# EAGLE design AY Card V2 (EAGLE 6.6.0)
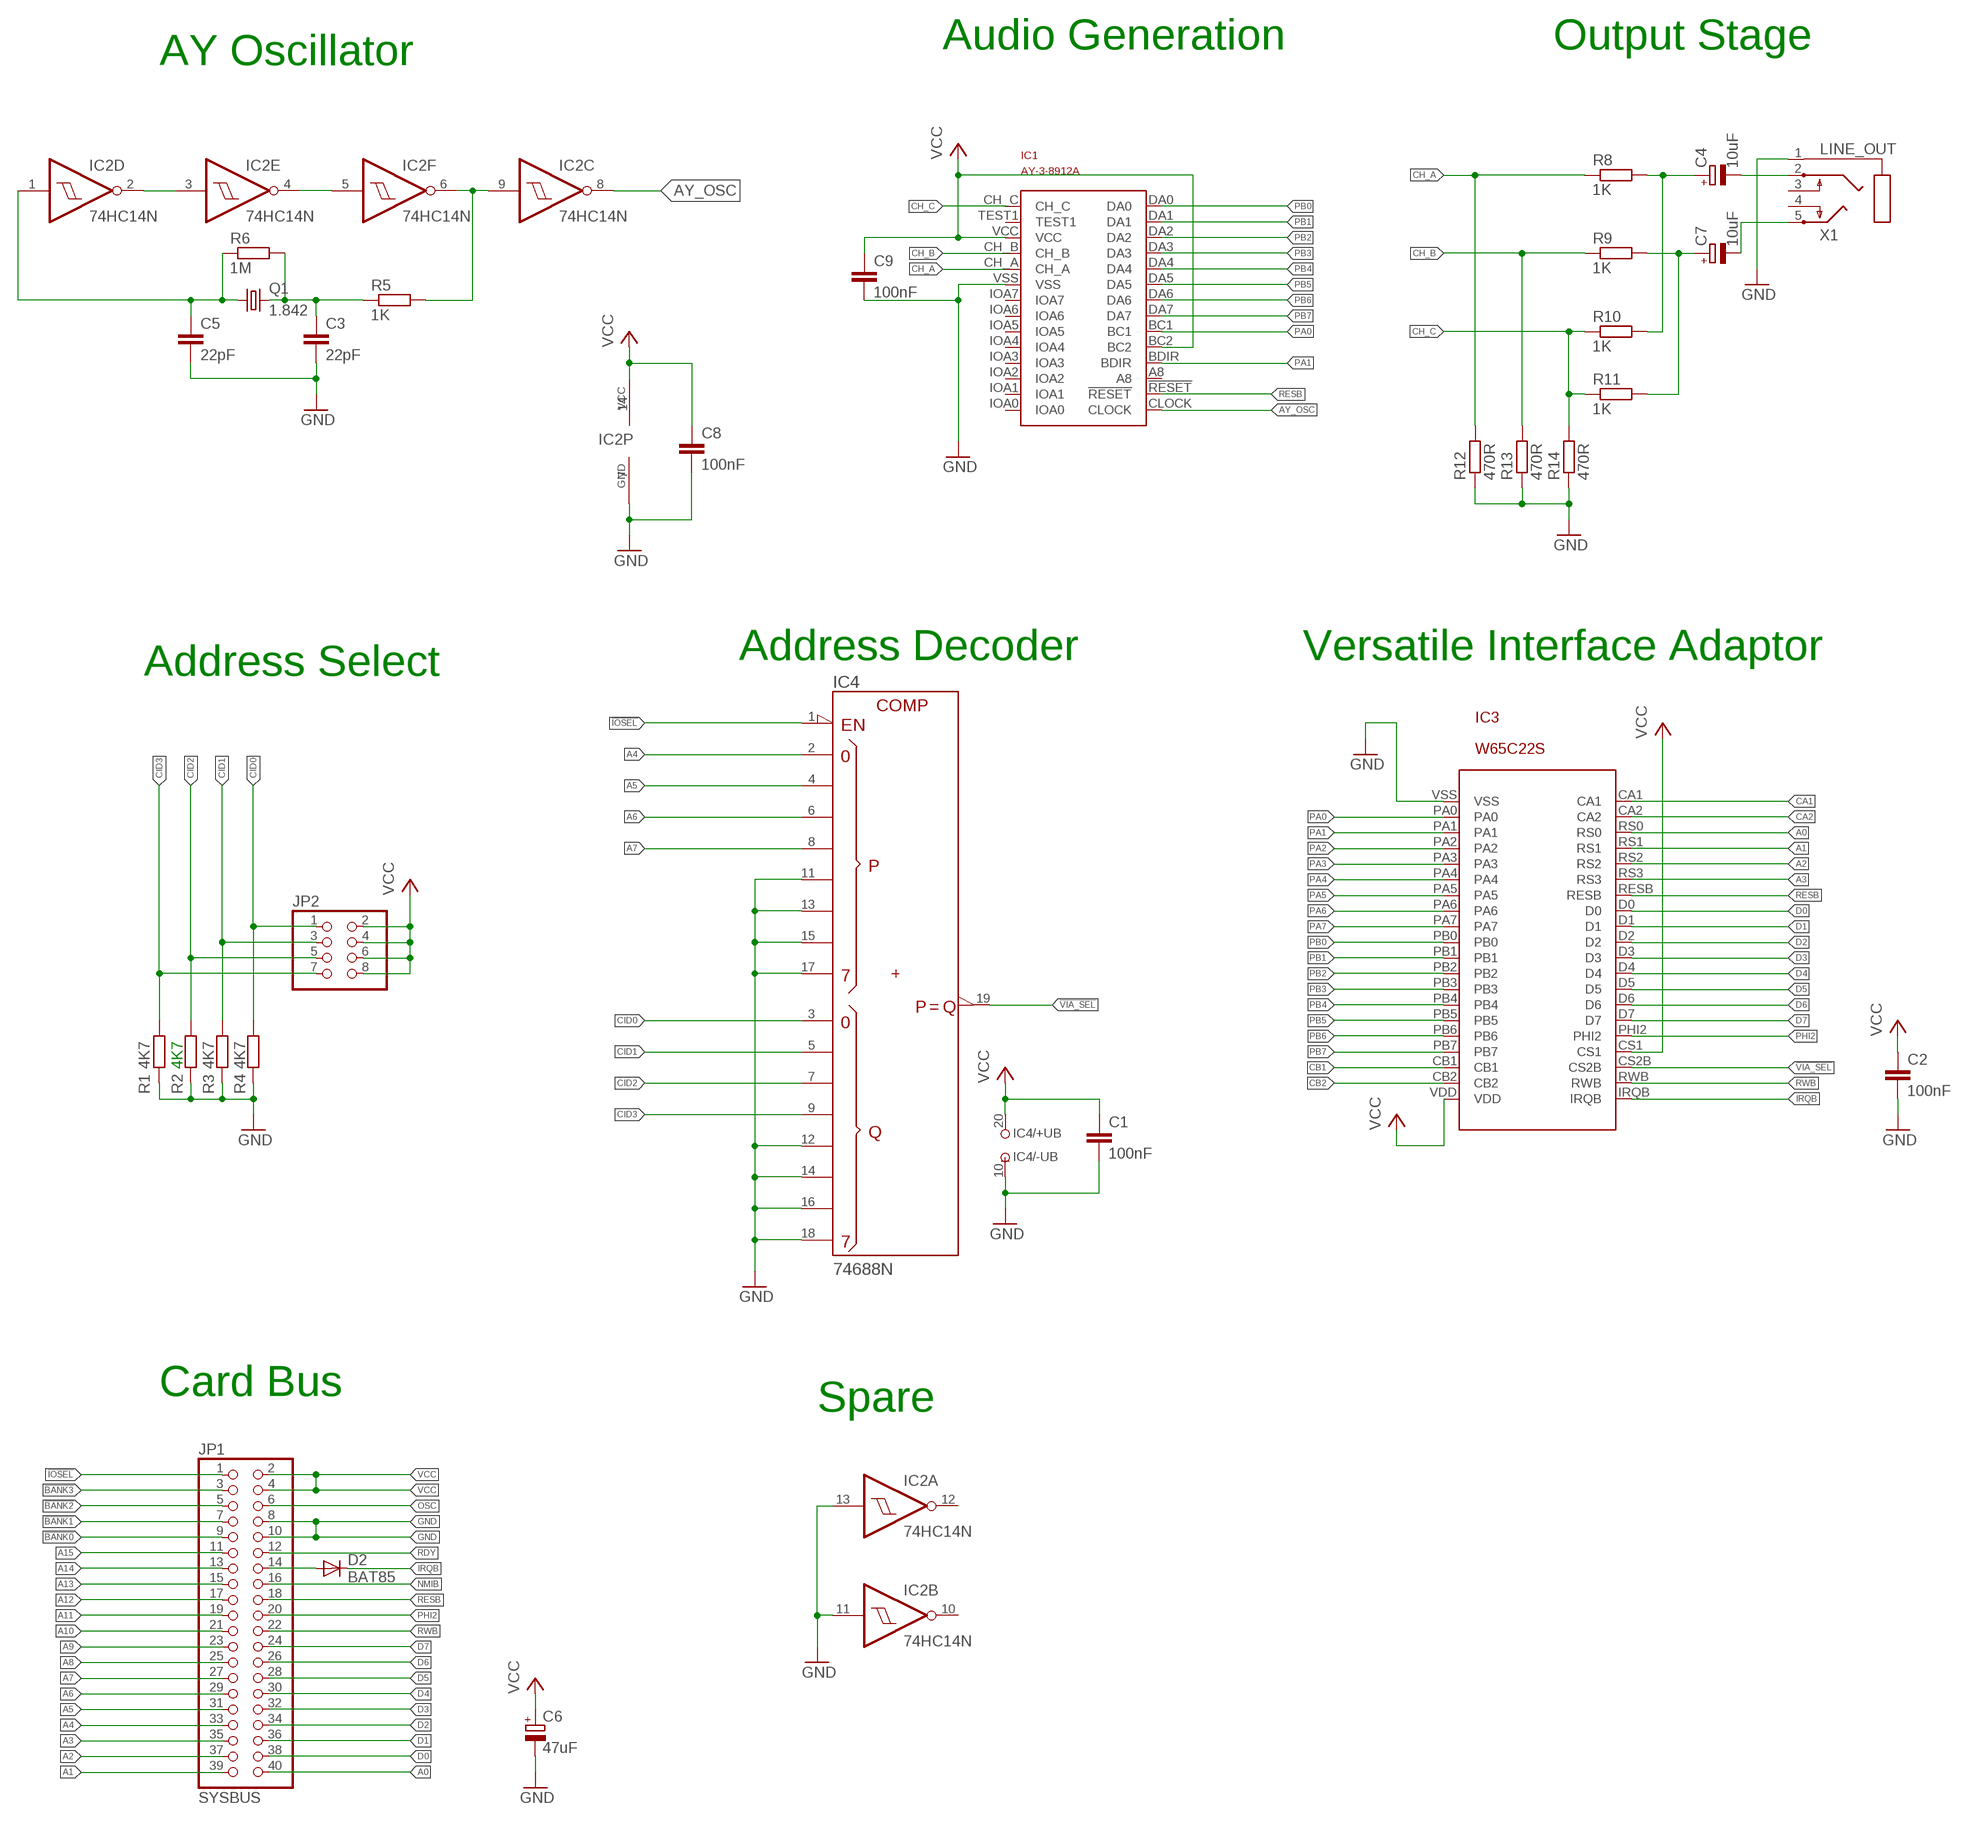
[diagram p0: schematic, sheet 1]

## Parts
C1  100nF  C-EU050-025X075  [C050-025X075]
C2  100nF  C-EU050-025X075  [C050-025X075]
C3  22pF  C-EU050-025X075  [C050-025X075]
C4  10uF  CPOL-EUE2-5  [E2-5]
C5  22pF  C-EU050-025X075  [C050-025X075]
C6  47uF  CPOL-EUE2.5-7  [E2,5-7]
C7  10uF  CPOL-EUE2-5  [E2-5]
C8  100nF  C-EU050-025X075  [C050-025X075]
C9  100nF  C-EU050-025X075  [C050-025X075]
D2  BAT85  BAT81  [DO34-7]
IC1  AY-3-8912A  AY-3-8912-DIP  [DIP]
IC2  74HC14N  7414N  [DIL14]
IC3  W65C22S  W65C22  [W65C22-DIP]
IC4  74688N  [DIL20]
JP1  SYSBUS  PINHD-2X20/90  [2X20/90]
JP2  PINHD-2X4  [2X04]
Q1  1.842  CRYSTALHC49S  [HC49/S]
R1  4K7  R-EU_0207/10  [0207/10]
R2  4K7  R-EU_0207/10  [0207/10]
R3  4K7  R-EU_0207/10  [0207/10]
R4  4K7  R-EU_0207/10  [0207/10]
R5  1K  R-EU_0207/2V  [0207/2V]
R6  1M  R-EU_0207/2V  [0207/2V]
R8  1K  R-EU_0207/2V  [0207/2V]
R9  1K  R-EU_0207/2V  [0207/2V]
R10  1K  R-EU_0207/2V  [0207/2V]
R11  1K  R-EU_0207/2V  [0207/2V]
R12  470R  R-EU_0207/2V  [0207/2V]
R13  470R  R-EU_0207/10  [0207/10]
R14  470R  R-EU_0207/10  [0207/10]
X1  LINE_OUT  STEREOJACK  [STX3100]

## Nets
!BANK0: JP1.9
!BANK1: JP1.7
!BANK2: JP1.5
!BANK3: JP1.3
!IOSEL: IC4.1(!G) JP1.1
!VIA_SEL: IC3.CS2B IC4.19(!P=Q)
A0: IC3.RS0 JP1.40
A1: IC3.RS1 JP1.39
A2: IC3.RS2 JP1.37
A3: IC3.RS3 JP1.35
A4: IC4.2(P0) JP1.33
A5: IC4.4(P1) JP1.31
A6: IC4.6(P2) JP1.29
A7: IC4.8(P3) JP1.27
A8: JP1.25
A9: JP1.23
A10: JP1.21
A11: JP1.19
A12: JP1.17
A13: JP1.15
A14: JP1.13
A15: JP1.11
AY_OSC: IC1.CLOCK IC2.8(C:O)
CA1: IC3.CA1
CA2: IC3.CA2
CB1: IC3.CB1
CB2: IC3.CB2
CH_A: IC1.CH_A R8.1 R12.2
CH_B: IC1.CH_B R9.1 R13.2
CH_C: IC1.CH_C R10.1 R11.1 R14.2
CID0: IC4.3(Q0) JP2.1 R4.2
CID1: IC4.5(Q1) JP2.3 R3.2
CID2: IC4.7(Q2) JP2.5 R2.2
CID3: IC4.9(Q3) JP2.7 R1.2
D0: IC3.D0 JP1.38
D1: IC3.D1 JP1.36
D2: IC3.D2 JP1.34
D3: IC3.D3 JP1.32
D4: IC3.D4 JP1.30
D5: IC3.D5 JP1.28
D6: IC3.D6 JP1.26
D7: IC3.D7 JP1.24
GND: C1.2 C2.2 C3.2 C5.2 C6.- C8.2 C9.2 IC1.VSS IC2.7(P:GND) IC2.11(B:I) IC2.13(A:I) IC3.VSS IC4.10(-UB) IC4.11(P4) IC4.12(Q4) IC4.13(P5) IC4.14(Q5) IC4.15(P6) IC4.16(Q6) IC4.17(P7) IC4.18(Q7) JP1.8 JP1.10 R1.1 R2.1 R3.1 R4.1 R12.1 R13.1 R14.1 X1.1
IRQB: D2.C IC3.IRQB
N$1: D2.A JP1.14
N$2: C4.+ R8.2 R10.2
N$3: C7.+ R9.2 R11.2
N$4: C7.- X1.5
N$5: C4.- X1.2
N$6: IC2.4(E:O) IC2.5(F:I)
N$7: IC2.6(F:O) IC2.9(C:I) R5.2
N$8: C3.1 Q1.2 R5.1 R6.2
N$9: C5.1 IC2.1(D:I) Q1.1 R6.1
N$10: IC2.2(D:O) IC2.3(E:I)
NMIB: JP1.16
OSC: JP1.6
PA0: IC1.BC1 IC3.PA0
PA1: IC1.BDIR IC3.PA1
PA2: IC3.PA2
PA3: IC3.PA3
PA4: IC3.PA4
PA5: IC3.PA5
PA6: IC3.PA6
PA7: IC3.PA7
PB0: IC1.DA0 IC3.PB0
PB1: IC1.DA1 IC3.PB1
PB2: IC1.DA2 IC3.PB2
PB3: IC1.DA3 IC3.PB3
PB4: IC1.DA4 IC3.PB4
PB5: IC1.DA5 IC3.PB5
PB6: IC1.DA6 IC3.PB6
PB7: IC1.DA7 IC3.PB7
PHI2: IC3.PHI2 JP1.20
RDY: JP1.12
RESB: IC1.!RESET IC3.RESB JP1.18
RWB: IC3.RWB JP1.22
VCC: C1.1 C2.1 C6.+ C8.1 C9.1 IC1.BC2 IC1.VCC IC2.14(P:VCC) IC3.CS1 IC3.VDD IC4.20(+UB) JP1.2 JP1.4 JP2.2 JP2.4 JP2.6 JP2.8
Unconnected: IC1.A8 IC1.IOA0 IC1.IOA1 IC1.IOA2 IC1.IOA3 IC1.IOA4 IC1.IOA5 IC1.IOA6 IC1.IOA7 IC1.TEST1 IC2.10(B:O) IC2.12(A:O) X1.3 X1.4

## Notes on the sheet
- Audio Generation | Output Stage
- AY Oscillator
- Address Decoder | Versatile Interface Adaptor
- Address Select
- Card Bus
- Spare

## Library data of the parts
C1-C3 C5 C8 C9 = rcl:C-EU: CAPACITOR, European symbol
C4 C6 C7 = rcl:CPOL-EU: POLARIZED CAPACITOR, European symbol
D2 = diode:BAT81: DIODE barrier diode
IC1 = ay-3-8912:AY-3-8912-DIP: Classic sound chip from the 80's Used in the Oric-1, Oric Atmos, Amstrad CPC's, some MSX's, Spectrum 128k machines etc.
IC2 = 74xx-us:74*14: Hex schmitt trigger INVERTER
IC3 = W65XX Support:W65C22
IC4 = 74ttl-din:74*688: 8-bit MAGNITUDE/IDENTITY COMPARATOR, totem pole
JP1 = pinhead:PINHD-2X20: PIN HEADER
JP2 = pinhead:PINHD-2X4: PIN HEADER
Q1 = crystal:CRYSTAL: CRYSTAL; OC_FARNELL: 1667008; OC_NEWARK: unknown
R1-R6 R8-R14 = rcl:R-EU_: RESISTOR, European symbol
X1 = adafruit:STEREOJACK: MIC/HEADPHONE JACK Stereo jack with two switches. Kycon STX3100, CUI SJ1-3555NG and/or 4UCon 05544

## Board
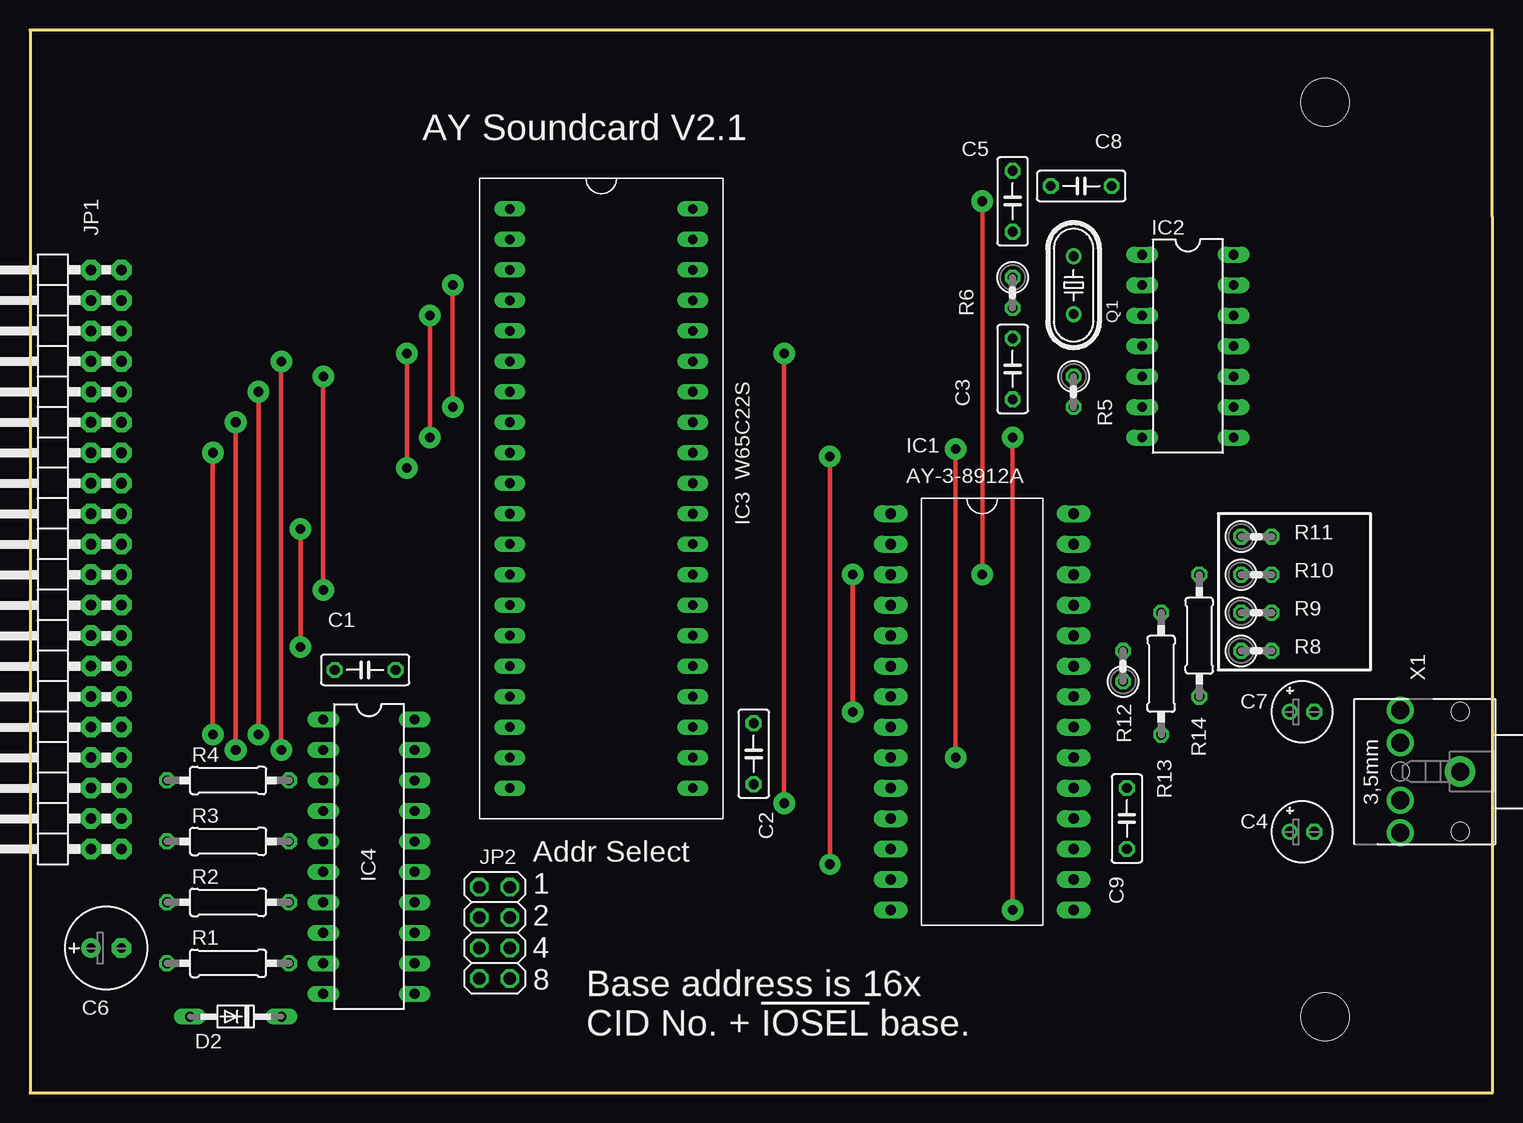
[diagram p1: board, top side]
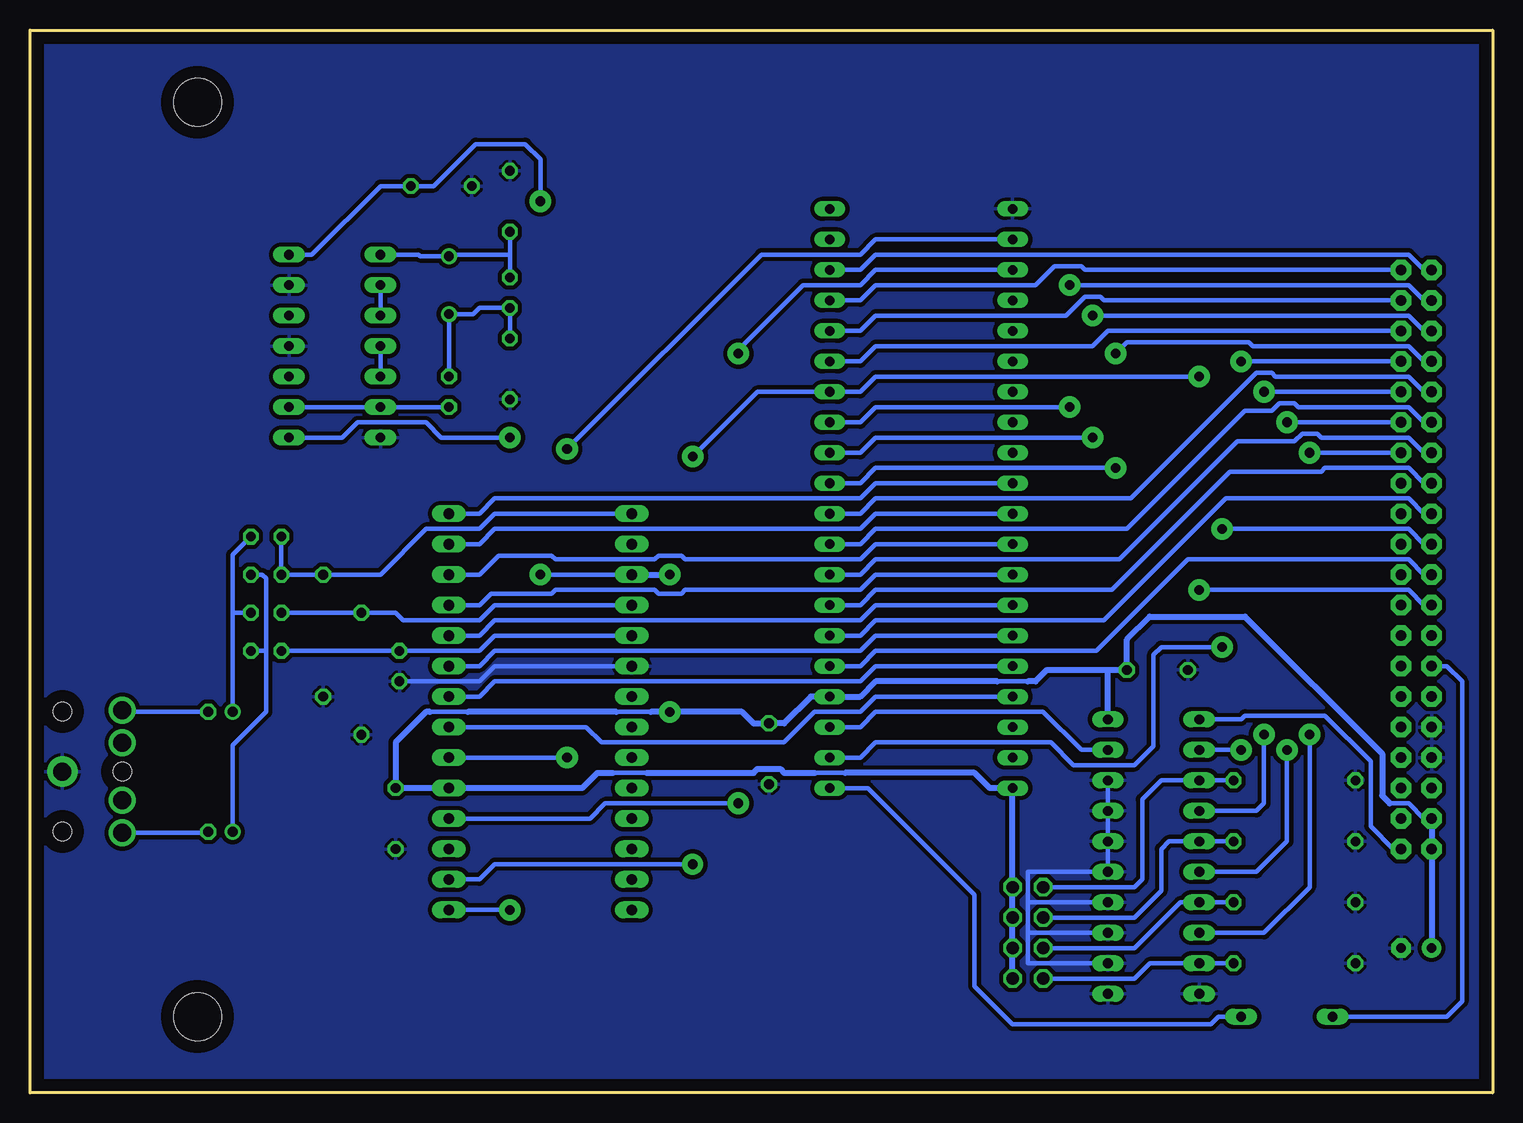
[diagram p2: board, bottom side, seen from below]

Size 121.92 x 88.57 mm. Coordinates in mm from the lower left corner, seen from the top.
Outline: 121.9,0 0,0 0,88.57 121.9,88.57 121.9,73.03 121.92,73.03 121.92,0
Copper layers (1*16): Top 0.035mm / dielectric 1.5mm / Bottom 0.035mm
Design rules "default *": minimum track width 10mil, minimum drill 24mil, track to track 6mil, track to pad 6mil, pad to pad 6mil, via to via 6mil, smd to smd 6mil, copper to edge 40mil, drill to drill 8mil, minimum pad ring 10mil, minimum via ring 8mil, stop-mask expansion 6mil, vias tented up to drill 0mil, thermal gap 10mil
Holes 4 mm at 107.95,82.55 107.95,6.35

### Footprints (pad centres in the part's own frame; a part is rotated, then mirrored left to right if it is on the bottom)
C050-025X075 = drill 0.813 octagon: 1 -2.54,0; 2 2.54,0
E2-5 = drill 0.813 pad 1.27: + -1.016,0 | drill 0.813 pad 1.27 octagon: - 1.016,0
E2,5-7 = drill 0.813 pad 1.6: + -1.27,0 | drill 0.813 pad 1.6 octagon: - 1.27,0
DO34-7 = drill 0.813 long: A 3.81,0; C -3.81,0
DIP = drill 0.9 long: !RESET 7.62,-15.24; A8 7.62,-12.7; BC1 7.62,-5.08; BC2 7.62,-7.62; BDIR 7.62,-10.16; CH_A -7.62,5.08; CH_B -7.62,7.62; CH_C -7.62,15.24; CLOCK 7.62,-17.78; DA0 7.62,15.24; DA1 7.62,12.7; DA2 7.62,10.16; DA3 7.62,7.62; DA4 7.62,5.08; DA5 7.62,2.54; DA6 7.62,0; DA7 7.62,-2.54; IOA0 -7.62,-17.78; IOA1 -7.62,-15.24; IOA2 -7.62,-12.7; IOA3 -7.62,-10.16; IOA4 -7.62,-7.62; IOA5 -7.62,-5.08; IOA6 -7.62,-2.54; IOA7 -7.62,0; TEST1 -7.62,12.7; VCC -7.62,10.16; VSS -7.62,2.54
DIL14 = drill 0.813 long: 1 -7.62,-3.81; 2 -5.08,-3.81; 3 -2.54,-3.81; 4 0,-3.81; 5 2.54,-3.81; 6 5.08,-3.81; 7 7.62,-3.81; 8 7.62,3.81; 9 5.08,3.81; 10 2.54,3.81; 11 0,3.81; 12 -2.54,3.81; 13 -5.08,3.81; 14 -7.62,3.81
W65C22-DIP = drill 0.8 long: CA1 7.62,24.13; CA2 7.62,21.59; CB1 -7.62,-19.05; CB2 -7.62,-21.59; CS1 7.62,-16.51; CS2B 7.62,-19.05; D0 7.62,6.35; D1 7.62,3.81; D2 7.62,1.27; D3 7.62,-1.27; D4 7.62,-3.81; D5 7.62,-6.35; D6 7.62,-8.89; D7 7.62,-11.43; IRQB 7.62,-24.13; PA0 -7.62,21.59; PA1 -7.62,19.05; PA2 -7.62,16.51; PA3 -7.62,13.97; PA4 -7.62,11.43; PA5 -7.62,8.89; PA6 -7.62,6.35; PA7 -7.62,3.81; PB0 -7.62,1.27; PB1 -7.62,-1.27; PB2 -7.62,-3.81; PB3 -7.62,-6.35; PB4 -7.62,-8.89; PB5 -7.62,-11.43; PB6 -7.62,-13.97; PB7 -7.62,-16.51; PHI2 7.62,-13.97; RESB 7.62,8.89; RS0 7.62,19.05; RS1 7.62,16.51; RS2 7.62,13.97; RS3 7.62,11.43; RWB 7.62,-21.59; VDD -7.62,-24.13; VSS -7.62,24.13
DIL20 = drill 0.813 long: 1 -11.43,-3.81; 2 -8.89,-3.81; 3 -6.35,-3.81; 4 -3.81,-3.81; 5 -1.27,-3.81; 6 1.27,-3.81; 7 3.81,-3.81; 8 6.35,-3.81; 9 8.89,-3.81; 10 11.43,-3.81; 11 11.43,3.81; 12 8.89,3.81; 13 6.35,3.81; 14 3.81,3.81; 15 1.27,3.81; 16 -1.27,3.81; 17 -3.81,3.81; 18 -6.35,3.81; 19 -8.89,3.81; 20 -11.43,3.81
2X20/90 = drill 0.889 pad 1.702 octagon: 1 -24.13,-6.35; 2 -24.13,-3.81; 3 -21.59,-6.35; 4 -21.59,-3.81; 5 -19.05,-6.35; 6 -19.05,-3.81; 7 -16.51,-6.35; 8 -16.51,-3.81; 9 -13.97,-6.35; 10 -13.97,-3.81; 11 -11.43,-6.35; 12 -11.43,-3.81; 13 -8.89,-6.35; 14 -8.89,-3.81; 15 -6.35,-6.35; 16 -6.35,-3.81; 17 -3.81,-6.35; 18 -3.81,-3.81; 19 -1.27,-6.35; 20 -1.27,-3.81; 21 1.27,-6.35; 22 1.27,-3.81; 23 3.81,-6.35; 24 3.81,-3.81; 25 6.35,-6.35; 26 6.35,-3.81; 27 8.89,-6.35; 28 8.89,-3.81; 29 11.43,-6.35; 30 11.43,-3.81; 31 13.97,-6.35; 32 13.97,-3.81; 33 16.51,-6.35; 34 16.51,-3.81; 35 19.05,-6.35; 36 19.05,-3.81; 37 21.59,-6.35; 38 21.59,-3.81; 39 24.13,-6.35; 40 24.13,-3.81
2X04 = drill 1.016 octagon: 1 -3.81,-1.27; 2 -3.81,1.27; 3 -1.27,-1.27; 4 -1.27,1.27; 5 1.27,-1.27; 6 1.27,1.27; 7 3.81,-1.27; 8 3.81,1.27
HC49/S = drill 0.813: 1 -2.413,0; 2 2.413,0
0207/10 = drill 0.813 octagon: 1 -5.08,0; 2 5.08,0
0207/2V = drill 0.813 octagon: 1 -1.27,0; 2 1.27,0
STX3100 = drill 1.5 pad 2.54: 1 2.7,-0.1 | drill 1.5: 2 7.7,5; 3 7.7,2.3; 4 7.7,-2.5; 5 7.7,-5.2 | hole 1.5: 2.7,4.9; 2.7,-5.1; 7.7,-0.1

### Placement (x,y rotation side)
C1  27.94,35.24 180 top
C2  60.33,28.26 270 top
C3  81.92,60.33 270 top
C4  106.05,21.75 0 top
C5  81.92,74.3 90 top
C6  6.35,12.06 0 top
C7  106.05,31.75 0 top
C8  87.63,75.56 180 top
C9  91.44,22.86 270 top
D2  17.14,6.35 180 top
IC1  79.38,33.02 0 top
IC2  96.52,62.23 270 top
IC3  47.62,49.53 0 top
IC4  28.26,19.68 270 top
JP1  1.27,44.45 90 top
JP2  38.73,13.34 270 top
Q1  87,67.31 270 top
R1  16.51,10.79 0 top
R2  16.51,15.88 0 top
R3  16.51,20.95 0 top
R4  16.51,26.04 0 top
R5  87,58.42 270 top
R6  81.92,66.67 270 top
R8  102.23,36.83 0 top
R9  102.23,40.01 0 top
R10  102.23,43.18 0 top
R11  102.23,46.35 0 top
R12  91.12,35.56 90 top
R13  94.3,34.92 90 top
R14  97.47,38.1 90 top
X1  121.92,26.67 180 top

### Tracks (layer width: path | path; a pad name or v marks a point on that pad's centre or on a via)
!IOSEL
  Bottom 0.356: IC4.1 20.95,31.11 20.64,31.43 13.97,31.43 10.16,27.62 10.16,22.23 8.26,20.32 JP1.1
!VIA_SEL
  Bottom 0.356: IC4.19 34.29,28.57 37.47,31.75 51.44,31.75 52.7,30.48 IC3.CS2B
A0
  Bottom 0.356: JP1.40 5.71,68.58 6.99,69.85 51.44,69.85 52.7,68.58 IC3.RS0
A1
  Bottom 0.356: JP1.39 33.97,68.58 34.29,68.9 36.51,68.9 38.1,67.31 51.44,67.31 52.7,66.04 IC3.RS1
A2
  Bottom 0.356: JP1.37 32.38,66.04 32.7,66.36 33.97,66.36 35.56,64.77 51.44,64.77 52.7,63.5 IC3.RS2
A3
  Bottom 0.356: JP1.35 32.07,63.5 33.34,62.23 51.44,62.23 52.7,60.96 IC3.RS3
A4  (via drill 0.8 pad 1.8)
  Top 0.356: v20.95,60.96 v20.95,28.57
  Bottom 0.356: JP1.33 v20.95,60.96 | IC4.2 v20.95,28.57
A5  (via drill 0.8 pad 1.8)
  Top 0.356: v19.05,58.42 v19.05,29.84
  Bottom 0.356: JP1.31 v19.05,58.42 | v19.05,29.84 19.05,24.13 19.68,23.5 IC4.4
A6  (via drill 0.8 pad 1.8)
  Top 0.356: v17.14,55.88 v17.14,28.57
  Bottom 0.356: JP1.29 v17.14,55.88 | v17.14,28.57 17.14,20.95 19.68,18.41 IC4.6
A7  (via drill 0.8 pad 1.8)
  Top 0.356: v15.24,53.34 v15.24,29.84
  Bottom 0.356: JP1.27 v15.24,53.34 | v15.24,29.84 15.24,17.14 19.05,13.34 IC4.8
AY_OSC  (via drill 0.8 pad 1.8)
  Top 0.356: v81.92,54.61 v81.92,15.24
  Bottom 0.356: IC2.8 95.89,54.61 94.61,55.88 88.9,55.88 87.63,54.61 v81.92,54.61 | v81.92,15.24 IC1.CLOCK
CH_A
  Bottom 0.356: IC1.CH_A 83.19,38.1 84.45,36.83 R12.2 R8.1
CH_B
  Bottom 0.356: IC1.CH_B 83.19,40.64 84.45,39.37 90.81,39.37 91.44,40.01 R13.2 R9.1
CH_C
  Bottom 0.356: IC1.CH_C 83.19,48.26 84.45,46.99 88.9,46.99 92.71,43.18 R14.2 R10.1 R11.1
CID0
  Bottom 0.356: JP2.1 29.84,17.14 29.21,17.78 29.21,24.45 27.62,26.04 IC4.3 R4.2
CID1
  Bottom 0.356: JP2.3 29.84,14.61 27.62,16.83 27.62,20.32 26.99,20.95 IC4.5 R3.2
CID2
  Bottom 0.356: JP2.5 29.84,12.06 26.04,15.88 IC4.7 R2.2
CID3
  Bottom 0.356: JP2.7 29.84,9.53 28.57,10.79 IC4.9 R1.2
D0  (via drill 0.8 pad 1.8)
  Top 0.356: v35.24,67.31 v35.24,57.15
  Bottom 0.356: JP1.38 5.71,66.04 6.99,67.31 v35.24,67.31 | v35.24,57.15 51.44,57.15 52.7,55.88 IC3.D0
D1  (via drill 0.8 pad 1.8)
  Top 0.356: v33.34,64.77 v33.34,54.61
  Bottom 0.356: JP1.36 5.71,63.5 6.99,64.77 v33.34,64.77 | v33.34,54.61 51.44,54.61 52.7,53.34 IC3.D1
D2  (via drill 0.8 pad 1.8)
  Top 0.356: v31.43,61.59 v31.43,52.07
  Bottom 0.356: JP1.34 5.71,60.96 6.99,62.23 20,62.23 20.32,62.55 30.48,62.55 v31.43,61.59 | v31.43,52.07 51.44,52.07 52.7,50.8 IC3.D2
D3
  Bottom 0.356: JP1.32 5.71,58.42 6.99,59.69 18.1,59.69 18.41,60.01 19.68,60.01 30.16,49.53 51.44,49.53 52.7,48.26 IC3.D3
D4
  Bottom 0.356: JP1.30 5.71,55.88 6.99,57.15 16.19,57.15 16.51,57.47 17.78,57.47 18.41,56.83 20.64,56.83 30.48,46.99 51.44,46.99 52.7,45.72 IC3.D4
D5
  Bottom 0.356: JP1.28 5.71,53.34 6.99,54.61 14.29,54.61 14.61,54.93 15.88,54.93 16.51,54.29 21.27,54.29 31.11,44.45 51.44,44.45 52.7,43.18 IC3.D5
D6
  Bottom 0.356: JP1.26 5.71,50.8 6.99,52.07 13.97,52.07 14.29,51.75 21.91,51.75 31.75,41.91 51.44,41.91 52.7,40.64 IC3.D6
D7
  Bottom 0.356: JP1.24 5.71,48.26 6.99,49.53 22.23,49.53 32.38,39.37 51.44,39.37 52.7,38.1 IC3.D7
GND
  Bottom 0.356: IC1.VSS 83.19,35.56 84.45,34.29 R12.1 | IC4.13 38.73,13.34 | 38.73,13.34 38.73,10.79 IC4.12 | IC4.18 IC4.17 IC4.16 IC4.15 38.73,18.41 38.73,15.88 | 38.73,15.88 38.73,13.34 | IC4.14 38.73,15.88
  pour Bottom (isolate 0.356): 0,88.9 0,0 122.24,0 122.24,88.9
IRQB
  Bottom 0.356: D2.C 22.86,6.35 23.5,5.71 40.01,5.71 43.18,8.89 43.18,16.51 52.07,25.4 IC3.IRQB
N$1
  Bottom 0.356: JP1.14 3.81,35.56 2.54,34.29 2.54,7.62 3.81,6.35 D2.A
N$2
  Bottom 0.356: R8.2 102.23,36.83 | 102.23,36.83 102.23,42.86 102.55,43.18 R10.2 | 102.23,36.83 102.23,31.75 105.03,28.96 C4.+
N$3
  Bottom 0.356: C7.+ 105.03,40.01 | 105.03,40.01 105.03,44.83 R11.2 | R9.2 105.03,40.01
N$4
  Bottom 0.356: X1.5 114.17,31.87 113.98,31.75 C7.-
N$5
  Bottom 0.356: X1.2 107.78,21.67 C4.-
N$6
  Bottom 0.356: IC2.4 IC2.5
N$7
  Bottom 0.356: R5.2 IC2.6 IC2.9
N$8
  Bottom 0.356: R5.1 Q1.2 84.96,64.9 84.45,65.41 R6.2 C3.1
N$9
  Bottom 0.356: IC2.1 89.53,69.85 89.41,69.72 Q1.1 86.87,69.85 81.92,69.85 | C5.1 81.92,69.85 | 81.92,69.85 R6.1
N$10
  Bottom 0.356: IC2.2 IC2.3
PA0  (via drill 0.8 pad 1.8)
  Top 0.356: v77.15,53.66 v77.15,27.94
  Bottom 0.356: IC3.PA0 51.44,71.12 52.7,69.85 60.96,69.85 v77.15,53.66 | v77.15,27.94 IC1.BC1
PA1  (via drill 0.8 pad 1.8)
  Top 0.356: v62.87,61.59 v62.87,24.13
  Bottom 0.356: IC3.PA1 51.44,68.58 52.7,67.31 57.47,67.31 62.87,61.91 v62.87,61.59 | v62.87,24.13 73.98,24.13 75.25,22.86 IC1.BDIR
PB0
  Bottom 0.356: IC3.PB0 51.44,50.8 52.7,49.53 83.19,49.53 84.45,48.26 IC1.DA0
PB1
  Bottom 0.356: IC1.DA1 84.45,45.72 83.19,46.99 52.7,46.99 51.44,48.26 IC3.PB1
PB2
  Bottom 0.356: IC1.DA2 84.45,43.18 82.87,44.77 78.42,44.77 78.11,44.45 69.85,44.45 69.53,44.77 67.63,44.77 67.31,44.45 52.7,44.45 51.44,45.72 IC3.PB2
PB3
  Bottom 0.356: IC1.DA3 84.45,40.64 83.5,41.59 78.42,41.59 78.11,41.91 69.85,41.91 69.53,41.59 67.63,41.59 67.31,41.91 52.7,41.91 51.44,43.18 IC3.PB3
PB4
  Bottom 0.356: IC1.DA4 84.45,38.1 83.19,39.37 52.7,39.37 51.44,40.64 IC3.PB4
PB5
  Bottom 0.356: IC1.DA5 84.45,35.56 83.19,36.83 52.7,36.83 51.44,38.1 IC3.PB5
PB6
  Bottom 0.356: IC1.DA6 84.45,33.02 83.19,34.29 52.7,34.29 51.44,35.56 IC3.PB6
PB7
  Bottom 0.356: IC1.DA7 75.56,30.48 74.3,29.21 59.05,29.21 56.52,31.75 52.7,31.75 51.44,33.02 IC3.PB7
PHI2
  Bottom 0.356: JP1.20 5.71,43.18 6.99,44.45 25.4,44.45 33.02,36.83 51.44,36.83 52.7,35.56 IC3.PHI2
RESB  (via drill 0.8 pad 1.75, 0.8 pad 1.8)
  Top 0.356: v24.45,41.91 v24.45,59.69 | v66.67,53.02 v66.67,19.05
  Bottom 0.356: JP1.18 5.71,40.64 6.99,41.91 v24.45,41.91 | v24.45,59.69 51.44,59.69 52.7,58.42 IC3.RESB 61.28,58.42 v66.67,53.02 | v66.67,19.05 83.19,19.05 84.45,17.78 IC1.!RESET
RWB  (via drill 0.8 pad 1.8)
  Top 0.356: v22.54,46.99 v22.54,37.15
  Bottom 0.356: JP1.22 5.71,45.72 6.99,46.99 v22.54,46.99 | IC3.RWB 52.7,27.94 51.44,29.21 36.83,29.21 34.92,27.3 29.84,27.3 28.26,28.89 28.26,36.51 27.62,37.15 v22.54,37.15
VCC  (via drill 0.8 pad 1.8)
  Top 0.356: v79.38,74.3 v79.38,43.18
  Top 0.406: v68.58,43.18 v68.58,31.75
  Bottom 0.356: 8.57,24.13 6.99,24.13 5.71,22.86 | 38.73,34.29 41.27,34.29 | 70.17,31.75 73.03,31.75 | 85.41,31.75 88.58,31.75 | 73.34,26.67 70.48,26.67 | 56.52,26.67 53.98,26.67 | v79.38,43.18 IC1.VCC | v79.38,74.3 79.38,77.79 80.64,79.06 84.77,79.06 88.27,75.56 C8.1 92.71,75.56 98.42,69.85 IC2.14
  Bottom 0.508: IC4.20 32.07,35.24 | 32.07,35.24 C1.1 30.48,37.78 28.57,39.69 20.64,39.69 9.21,28.26 9.21,24.77 8.57,24.13 | JP2.8 JP2.6 JP2.4 JP2.2 IC3.VDD 41.91,25.4 43.18,26.67 53.98,26.67 | C6.+ JP1.2 JP1.4 5.71,22.86 | IC1.VCC v68.58,43.18 | 32.07,35.24 37.15,35.24 38.1,34.29 38.73,34.29 | 41.27,34.29 51.44,34.29 52.7,33.02 IC3.CS1 56.83,33.02 59.05,30.8 C2.1 61.59,30.8 62.55,31.75 v68.58,31.75 70.17,31.75 | 73.03,31.75 85.41,31.75 | 88.58,31.75 88.9,31.75 91.44,29.21 C9.1 IC1.BC2 75.88,25.4 74.61,26.67 73.34,26.67 | 70.48,26.67 61.59,26.67 61.28,26.99 59.37,26.99 59.05,26.67 56.52,26.67

### Text on the board
tNames: AY Soundcard V2.1 | Base address is 16x / CID No. + !IOSEL! base.
_tNames: Addr Select / 1 / 2 / 4 / 8